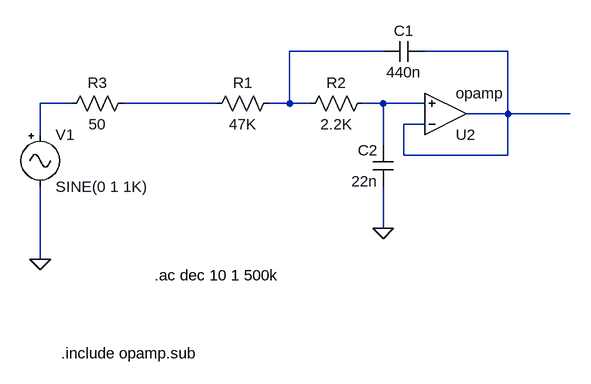
[diagram p0: schematic Experiment 3.asc]
Experiment 3.asc, the LTspice schematic file:
Version 4
SHEET 1 3376 680
WIRE 304 176 160 176
WIRE 496 176 368 176
WIRE -176 256 -224 256
WIRE 48 256 -96 256
WIRE 160 256 160 176
WIRE 160 256 128 256
WIRE 192 256 160 256
WIRE 304 256 272 256
WIRE 368 256 304 256
WIRE 496 272 496 176
WIRE 496 272 432 272
WIRE 592 272 496 272
WIRE 368 288 336 288
WIRE -224 304 -224 256
WIRE 304 320 304 256
WIRE 336 336 336 288
WIRE 496 336 496 272
WIRE 496 336 336 336
WIRE 304 448 304 384
WIRE -224 496 -224 384
FLAG -224 496 0
FLAG 304 448 0
SYMBOL res 144 240 R90
WINDOW 0 0 56 VBottom 2
WINDOW 3 32 56 VTop 2
SYMATTR InstName R1
SYMATTR Value 47K
SYMBOL res 288 240 R90
WINDOW 0 0 56 VBottom 2
WINDOW 3 32 56 VTop 2
SYMATTR InstName R2
SYMATTR Value 2.2K
SYMBOL res -80 240 R90
WINDOW 0 0 56 VBottom 2
WINDOW 3 32 56 VTop 2
SYMATTR InstName R3
SYMATTR Value 50
SYMBOL cap 368 160 R90
WINDOW 0 0 32 VBottom 2
WINDOW 3 32 32 VTop 2
SYMATTR InstName C1
SYMATTR Value 440n
SYMATTR SpiceLine Rser=35.9m Lser=0 mfg="   ---" pn="   ---" type="   ---"
SYMBOL cap 320 384 R180
WINDOW 0 24 56 Left 2
WINDOW 3 24 8 Left 2
SYMATTR InstName C2
SYMATTR Value 22n
SYMATTR SpiceLine Rser=38.6m Lser=319p mfg="Würth Elektronik" pn="885012207013 WCAP-CSGP 0805" type="X7R"
SYMBOL opamp 400 336 M180
SYMATTR InstName U2
SYMBOL signal -224 288 R0
SYMATTR InstName V1
SYMATTR Value2 AC 1
TEXT -48 520 Left 2 !.ac dec 10 1 500k
TEXT -192 640 Left 2 !.include opamp.sub

The netlist it stands for:
* Experiment 3.asc
R1 N001 N004 47K
R2 N005 N001 2.2K
R3 N004 N003 50
C1 N002 N001 440n Rser=35.9m Lser=0 mfg="   ---" pn="   ---" type="   ---"
C2 0 N005 22n Rser=38.6m Lser=319p mfg="Würth Elektronik" pn="885012207013 WCAP-CSGP 0805" type="X7R"
XU2 N002 N005 N002 opamp Aol=100K GBW=10Meg  ; pins invin noninvin out
V1 N003 0 SINE(0 1 1K) AC 1
.ac dec 10 1 500k
.include opamp.sub
.backanno
.end